# EAGLE schematic TeamH_PDB_SCH (EAGLE 9.6.2)
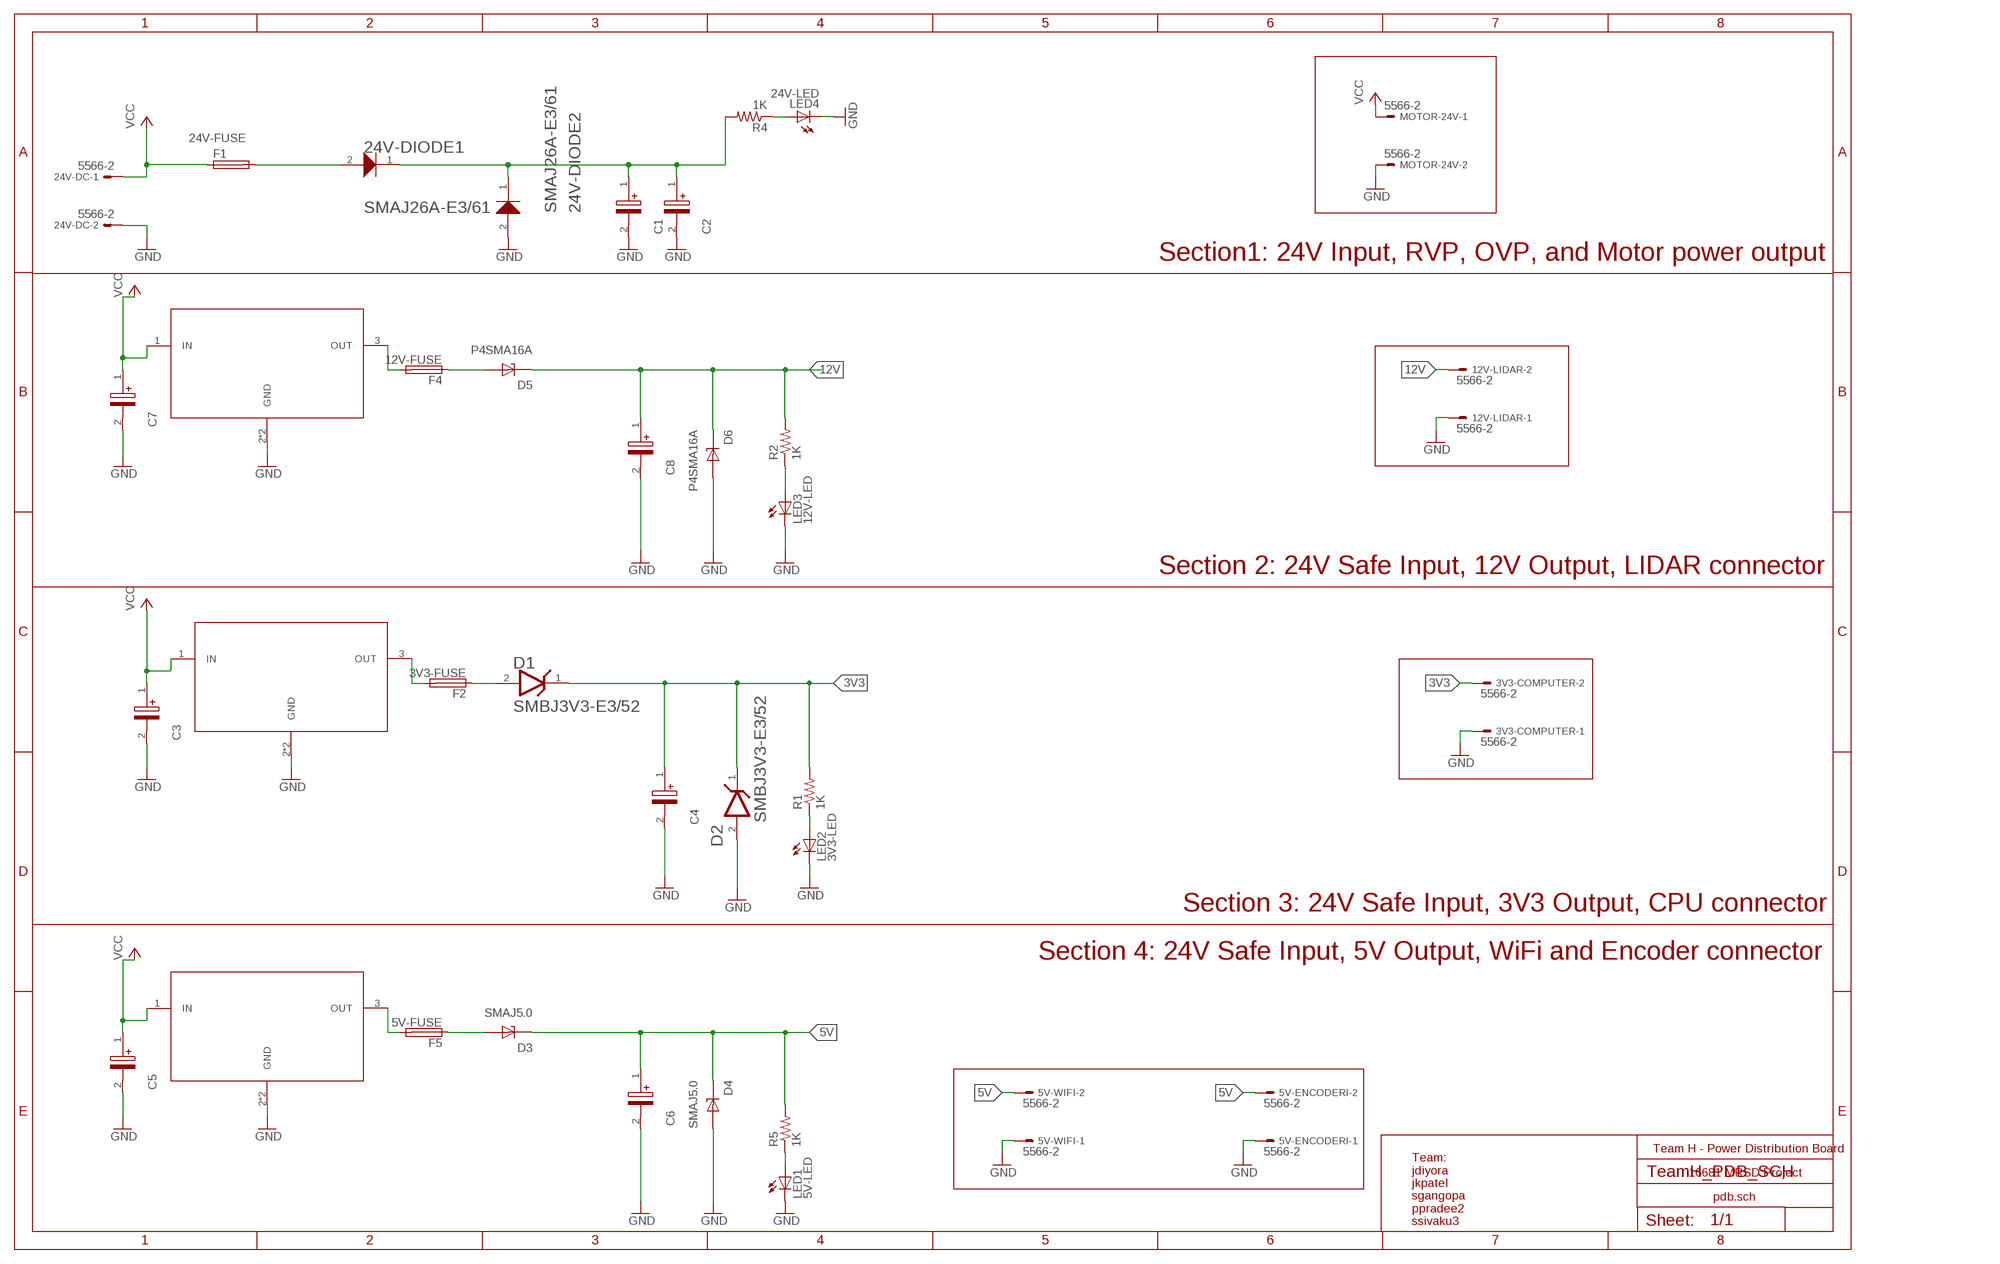
[diagram p0: schematic, sheet 1]

## Parts
3V3-COMPUTER  5566-2  [5566-2]
5V-ENCODERI  5566-2  [5566-2]
5V-WIFI  5566-2  [5566-2]
12V-LIDAR  5566-2  [5566-2]
24V-DC  5566-2  [5566-2]
24V-DIODE1  24V TVS  VISHAY_SEMICONDUCTOR_SMAJ26A-E3-61VISHAY_SEMICONDUCTOR_SMAJ26A-E3-61_0_2  [VISHAY_SEMICONDUCTOR_SMAJ26A-E3-61_2]
24V-DIODE2  24V TVS  VISHAY_SEMICONDUCTOR_SMAJ26A-E3-61VISHAY_SEMICONDUCTOR_SMAJ26A-E3-61_0_2  [VISHAY_SEMICONDUCTOR_SMAJ26A-E3-61_2]
C1  0.1uF  T489A106K010ATA2K2  [CAPPM3216X180N]
C2  10uF  T489A106K010ATA2K2  [CAPPM3216X180N]
C3  0.1uF  T489A106K010ATA2K2  [CAPPM3216X180N]
C4  0.1uF  T489A106K010ATA2K2  [CAPPM3216X180N]
C5  0.1uF  T489A106K010ATA2K2  [CAPPM3216X180N]
C6  0.1uF  T489A106K010ATA2K2  [CAPPM3216X180N]
C7  0.1uF  T489A106K010ATA2K2  [CAPPM3216X180N]
C8  0.1uF  T489A106K010ATA2K2  [CAPPM3216X180N]
D1  VISHAY_SMBJ3V3-E3-52VISHAY_SMBJ3V3-E3-52_0_0  [VISHAY_SMBJ3V3-E3-52_0]
D2  VISHAY_SMBJ3V3-E3-52VISHAY_SMBJ3V3-E3-52_0_0  [VISHAY_SMBJ3V3-E3-52_0]
D3  SMAJ5.0  [DIOM4325X250N]
D4  SMAJ5.0  [DIOM4325X250N]
D5  P4SMA16A  [DIOM4325X250N]
D6  P4SMA16A  [DIOM4325X250N]
F1  24V-FUSE  TE5  [TE5]
F2  3V3-FUSE  TE5  [TE5]
F4  12V-FUSE  TE5  [TE5]
F5  5V-FUSE  TE5  [TE5]
LED1  5V-LED  LEDCHIPLED_1206  [CHIPLED_1206]
LED2  3V3-LED  LEDCHIPLED_1206  [CHIPLED_1206]
LED3  12V-LED  LEDCHIPLED_1206  [CHIPLED_1206]
LED4  24V-LED  LEDCHIPLED_1206  [CHIPLED_1206]
MIC29300-3V3  3v3  MIC29300-12WU  [TO263]
MIC29300-5V  5v  MIC29300-12WU  [TO263]
MIC29300-12V  12v  MIC29300-12WU  [TO263]
MOTOR-24V  5566-2  [5566-2]
R1  1K  R-US_R1206  [R1206]
R2  1K  R-US_R1206  [R1206]
R4  1K  R-US_R1206  [R1206]
R5  1K  R-US_R1206  [R1206]

## Nets
3V3: 3V3-COMPUTER.2 C4.1(+) D1.1(CATHODE) D2.1(CATHODE) R1.2
5V [heavy]: 5V-ENCODERI.2 5V-WIFI.2 C6.1(+) D3.C D4.C R5.2
12V [heavy]: 12V-LIDAR.2 C8.1(+) D5.C D6.C R2.2
24VSAFE [heavy]: 24V-DIODE1.1(K) 24V-DIODE2.1(K) C1.1(+) C2.1(+) R4.2
GND [heavy]: 3V3-COMPUTER.1 5V-ENCODERI.1 5V-WIFI.1 12V-LIDAR.1 24V-DC.2 24V-DIODE2.2(A) C1.2(-) C2.2(-) C3.2(-) C4.2(-) C5.2(-) C6.2(-) C7.2(-) C8.2(-) D2.2(ANODE) D4.A D6.A LED1.C LED2.C LED3.C LED4.C MIC29300-3V3.2(GND) MIC29300-3V3.GND@(GND) MIC29300-5V.2(GND) MIC29300-5V.GND@(GND) MIC29300-12V.2(GND) MIC29300-12V.GND@(GND) MOTOR-24V.2
N$1: 24V-DIODE1.2(A) F1.2
N$6: F5.2 MIC29300-5V.3(OUT)
N$7: F4.2 MIC29300-12V.3(OUT)
N$9: D3.A F5.1
N$11: D5.A F4.1
N$14: LED4.A R4.1
N$16: F2.2 MIC29300-3V3.3(OUT)
N$17: D1.2(ANODE) F2.1
N$18: LED1.A R5.1
N$20: LED3.A R2.1
N$21: LED2.A R1.1
VCC [heavy]: 24V-DC.1 C3.1(+) C5.1(+) C7.1(+) F1.1 MIC29300-3V3.1(IN) MIC29300-5V.1(IN) MIC29300-12V.1(IN) MOTOR-24V.1

## Notes on the sheet
- Section1: 24V Input, RVP, OVP, and Motor power output
- Section 2: 24V Safe Input, 12V Output, LIDAR connector
- Section 3: 24V Safe Input, 3V3 Output, CPU connector
- Section 4: 24V Safe Input, 5V Output, WiFi and Encoder connector
- Team H - Power Distribution Board
- 16681 MRSD Project
- pdb.sch
- Team: 
  jdiyora 
  jkpatel
  sgangopa 
  ppradee2
  ssivaku3

## Library data of the parts
3V3-COMPUTER 5V-ENCODERI 5V-WIFI 12V-LIDAR 24V-DC MOTOR-24V = con-molex:5566-2: Mini FIT connector 2 pol Source: http://www.molex.com; MF: MOLEX; OC_FARNELL: 1822072; OC_NEWARK: unknown
24V-DIODE1 24V-DIODE2 = 26v61:VISHAY_SEMICONDUCTOR_SMAJ26A-E3-61: VISH-K1A2-2; CIIVA_IDS: 3122016; COMPONENT_LINK_1_DESCRIPTION: Manufacturer URL; COMPONENT_LINK_1_URL: http://www.vishay.com/; COMPONENT_LINK_3_DESCRIPTION: Package Specification; COMPONENT_LINK_3_URL: http://www.vishay.com/docs/88390/smaj50a.pdf; DATASHEET: http://www.vishay.com/docs/88390/smaj50a.pdf; DATASHEET_VERSION: 12/8/2013; FOOTPRINT_VARIANT_NAME_0: Level C; FOOTPRINT_VARIANT_NAME_1: Level B; FOOTPRINT_VARIANT_NAME_2: Level A; ID_UA: 1; IFSM: 40 A; IMPORTED: yes; IMPORTED_FROM: vault; IMPORT_TS: 1521861421; MF: Vishay Semiconductor; MOUNTING_TECHNOLOGY: Surface Mount; MPN: SMAJ26A-E3/61; OPERATING_JUNCTION_AND_STORAGE_TEMPERATURE_RANGE: -55 to 150 degC; PACKAGE: DO-214AC-2; PACKAGE_DESCRIPTION: 2-Pin DO-214AC (SMA), Body 4.245 x 2.665 mm; PACKING: Tape and Reel; PPPM_W: 400, 300; PREFIX: D; RELEASE_DATE: 1384933640; ROHS: Yes; VAULT_GUID: AD317694-DE0E-4C26-89D2-23B1414C378E; VAULT_REVISION: 6B730A9C-908D-494C-BC28-14F9434F73E3; VBR_UNI_DIRECTIONAL_V: 6.4 to 231; VWM_V: 26
C1-C8 = CAPS:T489A106K010ATA2K2: Tantalum Capacitors - Solid SMD 10V 10uF 1206 10% Source: Datasheet <https://www.mouser.in/datasheet/2/212/KEM_T2057_T489_AUTO-1774984.pdf>; DESCRIPTION: Tantalum Capacitors - Solid SMD 10V 10uF 1206 10%; HEIGHT: 1.8mm; MANUFACTURER_NAME: Kemet; MANUFACTURER_PART_NUMBER: T489A106K010ATA2K2; MOUSER_PART_NUMBER: 80-T489A106K10ATA2K2; MOUSER_PRICE-STOCK: https://www.mouser.co.uk/ProductDetail/KEMET/T489A106K010ATA2K2?qs=ds50AKTGxA%2Fc9bL0zBpU2Q%3D%3D
D1 D2 = 3v - SMBJ3V3-E3:52:VISHAY_SMBJ3V3-E3-52: Surface Mount TRANSZORB® Transient Voltage Suppressors; BREAKDOWN_VOLTAGE: 4.1V; CAPACITANCE: 5.2nF; CENTROID_NOT_SPECIFIED: No; CLAMPING_VOLTAGE: 10.3V; DATASHEET: http://www.vishay.com/docs/88940/smbj3v3.pdf; DEVICE_CLASS_L1: Circuit Protection; DEVICE_CLASS_L2: TVS Diodes; DEVICE_CLASS_L3: unset; DIGIKEY_DESCRIPTION: DIODE TVS DIODE 3.3V 10.3V DO214AA; DIGIKEY_PART_NUMBER: SMBJ3V3-E3/52GICT-ND; DIRECTION: Unidirectional; HEIGHT: 2.44mm; LEAD_FREE: yes; MAX_JUNCTION_TEMP: +175°C; MF: Vishay; MFG_PACKAGE_IDENT: SMBJ; MFG_PACKAGE_IDENT_DATE: 13/12/2013; MFG_PACKAGE_IDENT_REV: 0; MOUSER_DESCRIPTION: Diode: transil; 600W; 4.1V; 50A; unidirectional; SMB; TransZorb®; MOUSER_PART_NUMBER: 625-SMBJ3V3-E3; MPN: SMBJ3V3-E3/52; NUMBER_OF_CHANNELS: 1; PACKAGE: DO-214AA; PEAK_PULSE_CURRENT: 200A; PREFIX: D; REVERSE_STANDOFF_VOLTAGE: 3.3V; ROHS: yes; STANDOFF_HEIGHT: 0mm; VERIFICATION_VERSION: 0.0.0.1
D3 D4 = 5v - SMAJ5.0:SMAJ5.0: Check availability <https://pricing.snapeda.com/parts/SMAJ5.0/Littelfuse/view-part?ref=eda>; AVAILABILITY: In Stock; DESCRIPTION: 9.66V Clamp 43.5A Ipp Tvs Diode Surface Mount DO-214AC (SMA); MF: Littelfuse; MP: SMAJ5.0; PACKAGE: DO-214 Littelfuse; PRICE: None
D5 D6 = 16v - P4SMA16A:P4SMA16A: Check availability <https://pricing.snapeda.com/parts/P4SMA16A/Taiwan%20Semiconductor/view-part?ref=eda>; AVAILABILITY: In Stock; DESCRIPTION: 400W, 16V, 5%, Unidirectional, TVS; MF: Taiwan Semiconductor; MP: P4SMA16A; PACKAGE: DO-214AC-2 Taiwan Semiconductor; PRICE: None; PURCHASE-URL: https://pricing.snapeda.com/search/part/P4SMA16A/?ref=eda
F1 F2 F4 F5 = fuse:TE5: FUSE Wickmann; OC_FARNELL: unknown; OC_NEWARK: unknown
LED1-LED4 = led:LED: LED OSRAM: - CHIPLED LG R971, LG N971, LY N971, LG Q971, LY Q971, LO R971, LY R971 LH N974, LH R974 LS Q976, LO Q976, LY Q976 LO Q996 - Hyper CHIPLED LW Q18S LB Q993, LB Q99A, LB R99A - SideLED LS A670, LO A670, LY A670, LG A670, LP A670 LB A673, LV A673, LT A673, LW A673 LH A674 LY A675 LS A676, LA A676, LO A676, LY A676, LW A676 LS A679, LY A679, LG A679 - Hyper Micro SIDELED® LS Y876, LA Y876, LO Y876, LY Y876 LT Y87S - SmartLED LW L88C, LW L88S LB L89C, LB L89S, LG L890 LS L89K, LO L89K, LY L89K LS L896, LA L896, LO L896, LY L896 - TOPLED LS T670, LO T670, LY T670, LG T670, LP T670 LSG T670, LSP T670, LSY T670, LOP T670, LYG T670 LG T671, LOG T671, LSG T671 LB T673, LV T673, LT T673, LW T673 LH T674 LS T676, LA T676, LO T676, LY T676, LB T676, LH T676, LSB T676, LW T676 LB T67C, LV T67C, LT T67C, LS T67K, LO T67K, LY T67K, LW E67C LS E67B, LA E67B, LO E67B, LY E67B, LB E67C, LV E67C, LT E67C LW T67C LS T679, LY T679, LG T679 LS T770, LO T770, LY T770, LG T770, LP T770 LB T773, LV T773, LT T773, LW T773 LH T774 LS E675, LA E675, LY E675, LS T675 LS T776, LA T776, LO T776, LY T776, LB T776 LHGB T686 LT T68C, LB T68C - Hyper Mini TOPLED® LB M676 - Mini TOPLED Santana® LG M470 LS M47K, LO M47K, LY M47K Source: http://www.osram.convergy.de LUXEON: - LUMILED® LXK2-PW12-R00, LXK2-PW12-S00, LXK2-PW14-U00, LXK2-PW14-V00 LXK2-PM12-R00, LXK2-PM12-S00, LXK2-PM14-U00 LXK2-PE12-Q00, LXK2-PE12-R00, LXK2-PE12-S00, LXK2-PE14-T00, LXK2-PE14-U00 LXK2-PB12-K00, LXK2-PB12-L00, LXK2-PB12-M00, LXK2-PB14-N00, LXK2-PB14-P00, LXK2-PB14-Q00 LXK2-PR12-L00, LXK2-PR12-M00, LXK2-PR14-Q00, LXK2-PR14-R00 LXK2-PD12-Q00, LXK2-PD12-R00, LXK2-PD12-S00 LXK2-PH12-R00, LXK2-PH12-S00 LXK2-PL12-P00, LXK2-PL12-Q00, LXK2-PL12-R00 Source: www.luxeon.com KINGBRIGHT: KA-3528ASYC Source: www.kingbright.com
MIC29300-3V3 MIC29300-5V MIC29300-12V = temp:MIC29300-12WU: Check availability <https://pricing.snapeda.com/parts/MIC29300-12WU/Microchip%20Technology/view-part?ref=eda>; AVAILABILITY: In Stock; DESCRIPTION: Linear Voltage Regulator IC Positive Fixed 1 Output 3A TO-263-3; MF: Microchip Technology; MP: MIC29300-12WU; PACKAGE: None; PRICE: None; PURCHASE-URL: https://pricing.snapeda.com/search/part/MIC29300-12WU/?ref=eda
R1 R2 R4 R5 = rcl:R-US_: RESISTOR, American symbol; SPICEPREFIX: R

## Net classes
0 default: width 0.381 mm, clearance 0.127 mm
1 heavy: width 1.016 mm, clearance 0.127 mm